# EAGLE schematic eia-485-bus (EAGLE 7.5.0)
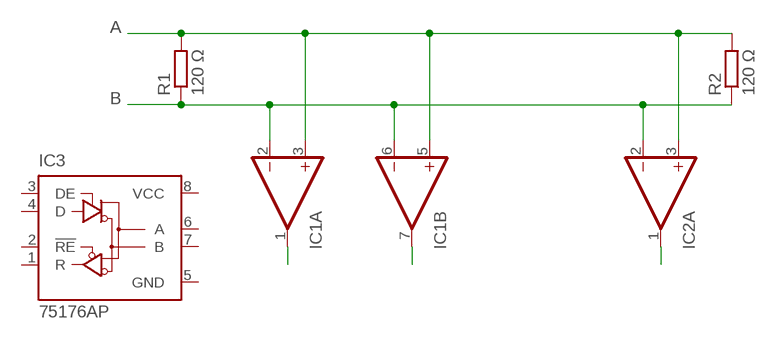
[diagram p0: schematic, sheet 1]

## Parts
IC1  2AMP_P8+4N  [DIL08]
IC2  2AMP_P8+4N  [DIL08]
IC3  75176AP  [DIL08]
R1  120 Ω  R-EU_0204/7  [0204/7]
R2  120 Ω  R-EU_0204/7  [0204/7]

## Nets
A: IC1.3(A:+IN) IC1.5(B:+IN) IC2.3(A:+IN) R1.2 R2.2
B: IC1.2(A:-IN) IC1.6(B:-IN) IC2.2(A:-IN) R1.1 R2.1
N$1: IC1.1(A:OUT)
N$2: IC1.7(B:OUT)
N$3: IC2.1(A:OUT)
Unconnected: IC2.5(B:+IN) IC2.6(B:-IN) IC2.7(B:OUT) IC3.1(R) IC3.2(!RE) IC3.3(DE) IC3.4(D) IC3.6(A) IC3.7(B)

## Power pins joined to a net without a drawn wire
GND: IC3.5(GND)
V+: IC1.8(P:V+) IC2.8(P:V+)
V-: IC1.4(P:V-) IC2.4(P:V-)
VCC: IC3.8(VCC)

## Library data of the parts
IC1 IC2 = linear:2AMP_P8+4: OP AMP
IC3 = 751xx:75176A: DIFFERENTIAL BUS TRANSCEIVER Source: http://focus.ti.com/lit/ds/symlink/sn75176a.pdf
R1 R2 = resistor:R-EU_: RESISTOR, European symbol